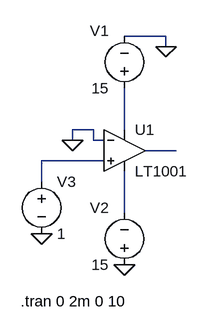
[diagram p0: schematic LT1001_lab2_q3b.asc]
LT1001_lab2_q3b.asc, the LTspice schematic file:
Version 4
SHEET 1 880 680
WIRE 176 96 112 96
WIRE 176 112 176 96
WIRE 64 240 32 240
WIRE 112 240 112 176
WIRE 32 256 32 240
WIRE 64 256 64 240
WIRE 80 256 64 256
WIRE 192 272 144 272
WIRE 80 288 -16 288
WIRE -16 320 -16 288
WIRE 112 368 112 304
FLAG 176 112 0
FLAG 112 448 0
FLAG -16 400 0
FLAG 32 256 0
SYMBOL Opamps\\LT1001 112 208 R0
SYMATTR InstName U1
SYMBOL voltage 112 192 R180
WINDOW 0 24 104 Left 0
WINDOW 3 24 16 Left 0
WINDOW 123 0 0 Left 0
WINDOW 39 0 0 Left 0
SYMATTR InstName V1
SYMATTR Value 15
SYMBOL voltage 112 464 R180
WINDOW 0 24 104 Left 0
WINDOW 3 24 16 Left 0
WINDOW 123 0 0 Left 0
WINDOW 39 0 0 Left 0
SYMATTR InstName V2
SYMATTR Value 15
SYMBOL voltage -16 304 R0
WINDOW 123 0 0 Left 0
WINDOW 39 0 0 Left 0
SYMATTR InstName V3
SYMATTR Value 1
TEXT -48 504 Left 0 !.tran 0 2m 0 10

The netlist it stands for:
* LT1001_lab2_q3b.asc
XU1 N003 0 N001 N004 N002 LT1001  ; pins In+ In- V+ V- OUT
V1 N001 0 15
V2 0 N004 15
V3 N003 0 1
.tran 0 2m 0 10
.lib LTC.lib
.backanno
.end